# EAGLE design breakout (EAGLE 6.4)
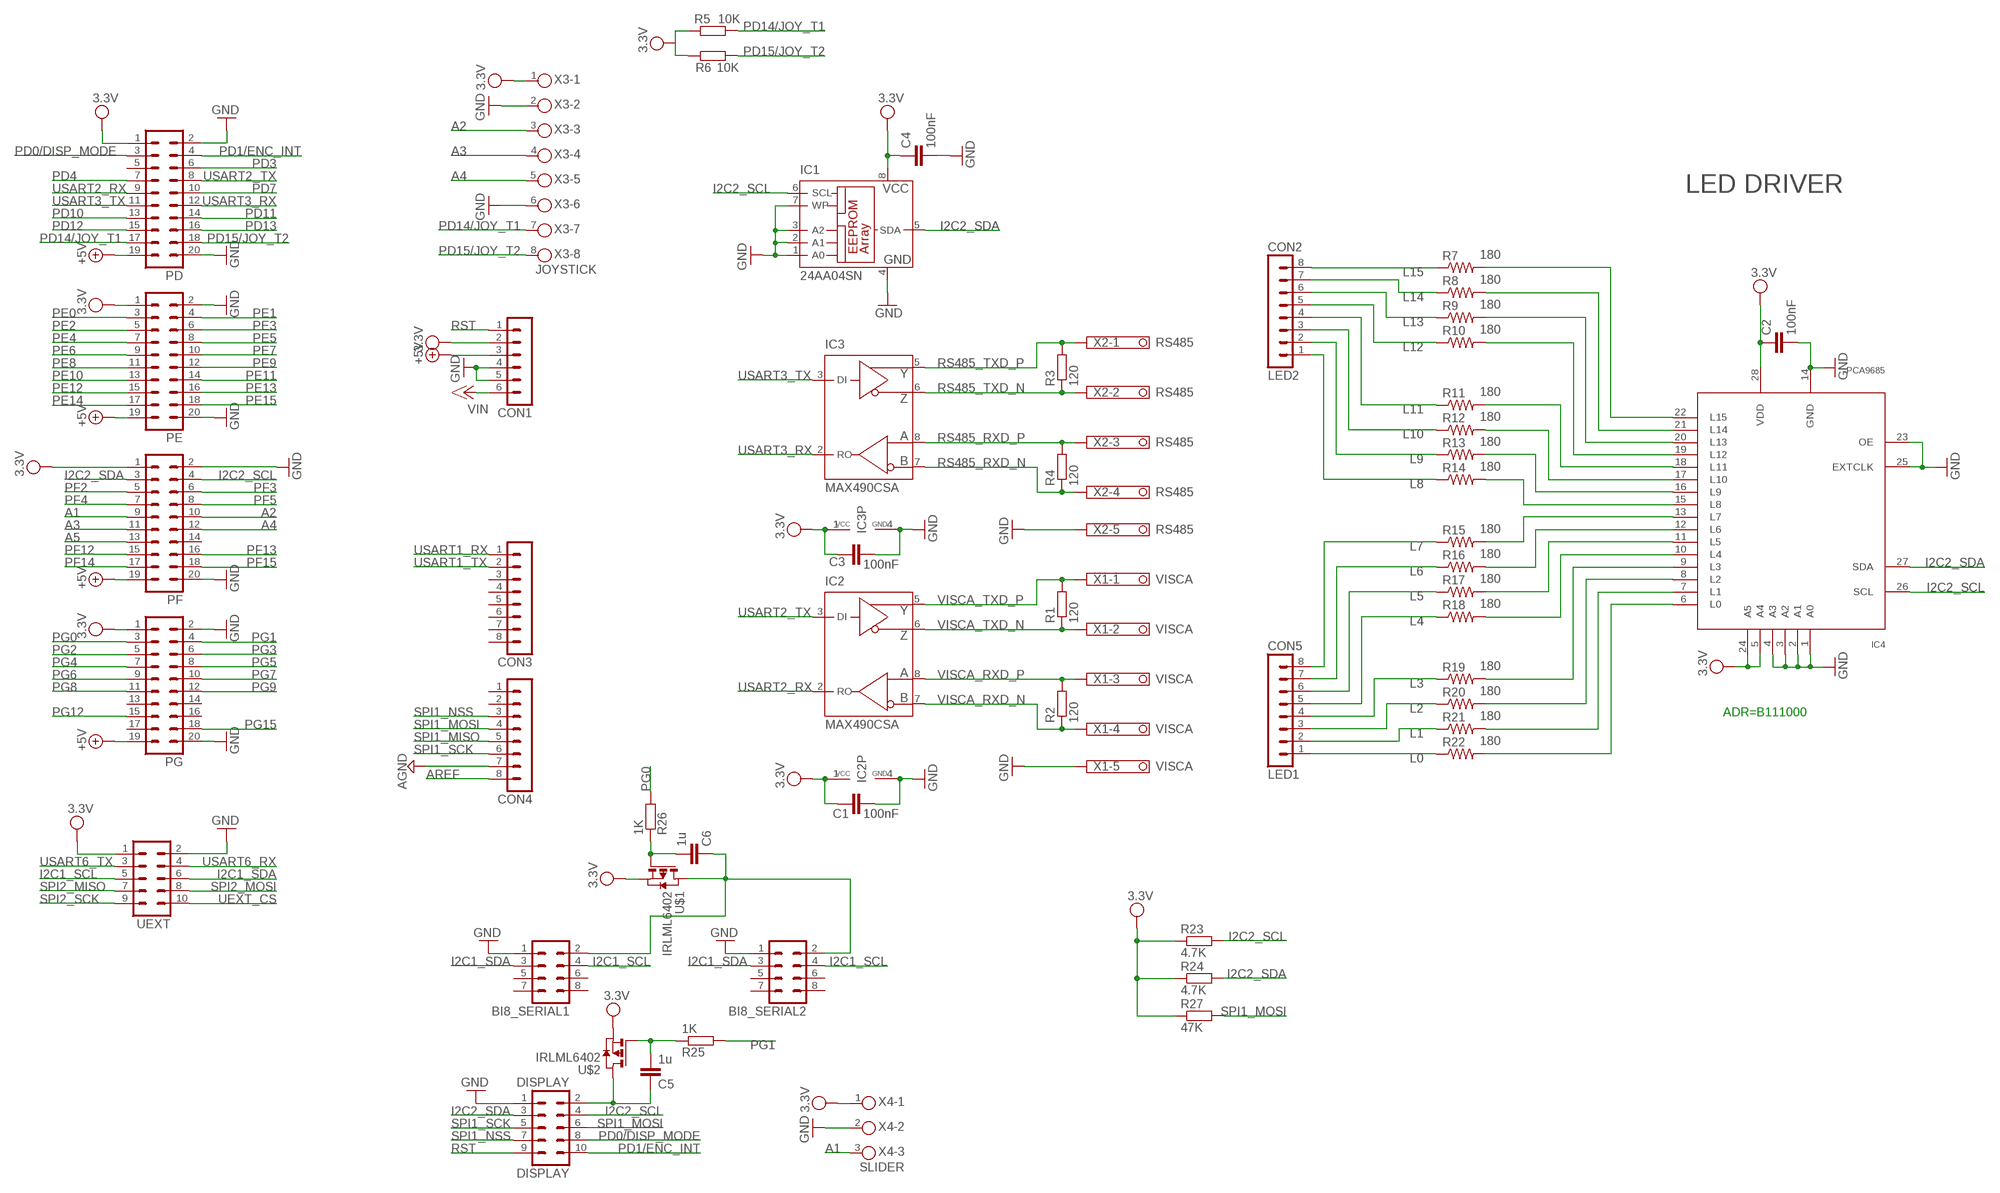
[diagram p0: schematic, sheet 1]

## Parts
BI8_SERIAL1  MA04-2  [MA04-2]
BI8_SERIAL2  MA04-2  [MA04-2]
C1  100nF  CAP0603-CAP  [0603-CAP]
C2  100nF  CAP0603-CAP  [0603-CAP]
C3  100nF  CAP0603-CAP  [0603-CAP]
C4  100nF  CAP0603-CAP  [0603-CAP]
C5  1u  C-EUC0805  [C0805]
C6  1u  C-EUC0805  [C0805]
CON1  MA06-1  [MA06-1]
CON2  LED2  MA08-1  [MA08-1]
CON3  MA08-1  [MA08-1]
CON4  MA08-1  [MA08-1]
CON5  LED1  MA08-1  [MA08-1]
DISPLAY  DISPLAY  MA05-2  [MA05-2]
IC1  24AA04SN  [SO-08]
IC2  MAX490CSA  MAX488CSA  [SO08]
IC3  MAX490CSA  MAX488CSA  [SO08]
IC4  PCA9685  [TSSOP28]
PD  MA10-2  [MA10-2]
PE  MA10-2  [MA10-2]
PF  MA10-2  [MA10-2]
PG  MA10-2  [MA10-2]
R1  120  R-EU_R0603  [R0603]
R2  120  R-EU_R0603  [R0603]
R3  120  R-EU_R0603  [R0603]
R4  120  R-EU_R0603  [R0603]
R5  10K  R-EU_R0603  [R0603]
R6  10K  R-EU_R0603  [R0603]
R7  180  RESISTOR0603-RES  [0603-RES]
R8  180  RESISTOR0603-RES  [0603-RES]
R9  180  RESISTOR0603-RES  [0603-RES]
R10  180  RESISTOR0603-RES  [0603-RES]
R11  180  RESISTOR0603-RES  [0603-RES]
R12  180  RESISTOR0603-RES  [0603-RES]
R13  180  RESISTOR0603-RES  [0603-RES]
R14  180  RESISTOR0603-RES  [0603-RES]
R15  180  RESISTOR0603-RES  [0603-RES]
R16  180  RESISTOR0603-RES  [0603-RES]
R17  180  RESISTOR0603-RES  [0603-RES]
R18  180  RESISTOR0603-RES  [0603-RES]
R19  180  RESISTOR0603-RES  [0603-RES]
R20  180  RESISTOR0603-RES  [0603-RES]
R21  180  RESISTOR0603-RES  [0603-RES]
R22  180  RESISTOR0603-RES  [0603-RES]
R23  4.7K  R-EU_R0603  [R0603]
R24  4.7K  R-EU_R0603  [R0603]
R25  1K  R-EU_R0603  [R0603]
R26  1K  R-EU_R0603  [R0603]
R27  47K  R-EU_R0603  [R0603]
U$1  IRLML6402  [SOT-23]
U$2  IRLML6402  [SOT-23]
UEXT  ML10L  [ML10L]
X1  VISCA  1751277  [1751277]
X2  RS485  1751277  [1751277]
X3  JOYSTICK  AKL59-08  [8POL35]
X4  SLIDER  AKL59-03  [3POL35]

## Nets
+5V: CON1.3 PD.19 PE.19 PF.19 PG.19
A1: PF.9 X4.3
A2: PF.10 X3.3
A3: PF.11 X3.4
A4: PF.12 X3.5
A5: PF.13
AGND: CON4.7
AREF: CON4.8
GND: BI8_SERIAL1.1 BI8_SERIAL2.1 C1.2 C2.2 C3.2 C4.2 CON1.4 CON1.5 DISPLAY.1 IC1.1(A0) IC1.2(A1) IC1.3(A2) IC1.4(GND) IC1.7(WP) IC2.4(GND) IC3.4(GND) IC4.1(A0) IC4.2(A1) IC4.3(A2) IC4.4(A3) IC4.14(GND) IC4.23(OE) IC4.25(EXTCLK) PD.2 PD.20 PE.2 PE.20 PF.2 PF.20 PG.2 PG.20 UEXT.2 X1.5 X2.5 X3.2 X3.6 X4.2
I2C1_SCL: BI8_SERIAL1.4 BI8_SERIAL2.4 UEXT.5
I2C1_SDA: BI8_SERIAL1.3 BI8_SERIAL2.3 UEXT.6
I2C2_SCL: DISPLAY.4 IC1.6(SCL) IC4.26(SCL) PF.4 R23.2
I2C2_SDA: DISPLAY.3 IC1.5(SDA) IC4.27(SDA) PF.3 R24.2
L0: CON5.1 R22.1
L1: CON5.2 R21.1
L2: CON5.3 R20.1
L3: CON5.4 R19.1
L4: CON5.5 R18.1
L5: CON5.6 R17.1
L6: CON5.7 R16.1
L7: CON5.8 R15.1
L8: CON2.1 R14.1
L9: CON2.2 R13.1
L10: CON2.3 R12.1
L11: CON2.4 R11.1
L12: CON2.5 R10.1
L13: CON2.6 R9.1
L14: CON2.7 R8.1
L15: CON2.8 R7.1
N$3: C5.2 R25.1 U$2.1(G)
N$4: IC4.13(L7) R15.2
N$5: IC4.12(L6) R16.2
N$6: C6.2 R26.1 U$1.1(G)
N$7: IC4.11(L5) R17.2
N$8: BI8_SERIAL1.2 BI8_SERIAL2.2 C6.1 U$1.3(D)
N$9: IC4.10(L4) R18.2
N$10: IC4.9(L3) R19.2
N$11: IC4.8(L2) R20.2
N$12: IC4.7(L1) R21.2
N$13: C5.1 DISPLAY.2 U$2.3(D)
N$19: IC4.6(L0) R22.2
N$20: IC4.15(L8) R14.2
N$21: IC4.16(L9) R13.2
N$22: IC4.17(L10) R12.2
N$23: IC4.18(L11) R11.2
N$24: IC4.19(L12) R10.2
N$25: IC4.20(L13) R9.2
N$26: IC4.21(L14) R8.2
N$27: IC4.22(L15) R7.2
PD0/DISP_MODE: DISPLAY.8 PD.3
PD1/ENC_INT: DISPLAY.10 PD.4
PD3: PD.6
PD4: PD.7
PD7: PD.10
PD10: PD.13
PD11: PD.14
PD12: PD.15
PD13: PD.16
PD14/JOY_T1: PD.17 R5.2 X3.7
PD15/JOY_T2: PD.18 R6.2 X3.8
PE0: PE.3
PE1: PE.4
PE2: PE.5
PE3: PE.6
PE4: PE.7
PE5: PE.8
PE6: PE.9
PE7: PE.10
PE8: PE.11
PE9: PE.12
PE10: PE.13
PE11: PE.14
PE12: PE.15
PE13: PE.16
PE14: PE.17
PE15: PE.18
PF2: PF.5
PF3: PF.6
PF4: PF.7
PF5: PF.8
PF12: PF.15
PF13: PF.16
PF14: PF.17
PF15: PF.18
PG0: PG.3 R26.2
PG1: PG.4 R25.2
PG2: PG.5
PG3: PG.6
PG4: PG.7
PG5: PG.8
PG6: PG.9
PG7: PG.10
PG8: PG.11
PG9: PG.12
PG12: PG.15
PG15: PG.18
RS485_RXD_N: IC3.7(B) R4.1 X2.4
RS485_RXD_P: IC3.8(A) R4.2 X2.3
RS485_TXD_N: IC3.6(Z) R3.1 X2.2
RS485_TXD_P: IC3.5(Y) R3.2 X2.1
RST: CON1.1 DISPLAY.9
SPI1_MISO: CON4.5
SPI1_MOSI: CON4.4 DISPLAY.6 R27.2
SPI1_NSS: CON4.3 DISPLAY.7
SPI1_SCK: CON4.6 DISPLAY.5
SPI2_MISO: UEXT.7
SPI2_MOSI: UEXT.8
SPI2_SCK: UEXT.9
UEXT_CS: UEXT.10
USART1_RX: CON3.1
USART1_TX: CON3.2
USART2_RX: IC2.2(RO) PD.9
USART2_TX: IC2.3(DI) PD.8
USART3_RX: IC3.2(RO) PD.12
USART3_TX: IC3.3(DI) PD.11
USART6_RX: UEXT.4
USART6_TX: UEXT.3
VCC: C1.1 C2.1 C3.1 C4.1 CON1.2 IC1.8(VCC) IC2.1(VCC) IC3.1(VCC) IC4.5(A4) IC4.24(A5) IC4.28(VDD) PD.1 PE.1 PF.1 PG.1 R5.1 R6.1 R23.1 R24.1 R27.1 U$1.2(S) U$2.2(S) UEXT.1 X3.1 X4.1 ; supply symbol labelled 3.3V
VIN: CON1.6
VISCA_RXD_N: IC2.7(B) R2.1 X1.4
VISCA_RXD_P: IC2.8(A) R2.2 X1.3
VISCA_TXD_N: IC2.6(Z) R1.1 X1.2
VISCA_TXD_P: IC2.5(Y) R1.2 X1.1
Unconnected: BI8_SERIAL1.5 BI8_SERIAL1.6 BI8_SERIAL1.7 BI8_SERIAL1.8 BI8_SERIAL2.5 BI8_SERIAL2.6 BI8_SERIAL2.7 BI8_SERIAL2.8 CON3.3 CON3.4 CON3.5 CON3.6 CON3.7 CON3.8 CON4.1 CON4.2 PD.5 PF.14 PG.13 PG.14 PG.16 PG.17

## Notes on the sheet
- LED DRIVER
- ADR=B111000

## Library data of the parts
BI8_SERIAL1 BI8_SERIAL2 = con-lstb:MA04-2: PIN HEADER; OC_FARNELL: unknown; OC_NEWARK: unknown
C1-C4 = SparkFun:CAP: Capacitor Standard 0603 ceramic capacitor, and 0.1" leaded capacitor.
C5 C6 = resistor:C-EU: CAPACITOR, European symbol
CON1 = con-lstb:MA06-1: PIN HEADER; OC_FARNELL: unknown; OC_NEWARK: unknown
CON2-CON5 = con-lstb:MA08-1: PIN HEADER; OC_FARNELL: unknown; OC_NEWARK: unknown
DISPLAY = con-lstb:MA05-2: PIN HEADER; OC_FARNELL: unknown; OC_NEWARK: unknown
IC1 = microchip:24*: Serial EEPROM I2C; MF: MICROCHIP; MPN: 24AA04/SN; OC_FARNELL: 1331276; OC_NEWARK: 92C6818
IC2 IC3 = maxim:MAX488: RS485 TRANSEIVER Source: Data sheet <http://datasheets.maxim-ic.com/en/ds/MAX1487-MAX491.pdf>; MF: MAXIM; MPN: MAX488CSA; OC_FARNELL: 3534170; OC_NEWARK: 34C3921
IC4 = wsmith:PCA9685
PD PE PF PG = con-lstb:MA10-2: PIN HEADER; OC_FARNELL: unknown; OC_NEWARK: unknown
R1-R6 R23-R27 = resistor:R-EU_: RESISTOR, European symbol
R7-R22 = SparkFun:RESISTOR: Resistor Basic schematic elements and footprints for 0603, 1206, and PTH resistors.
U$1 U$2 = IRLML6402:IRLML6402
UEXT = con-harting-ml:ML10: HARTING; OC_FARNELL: unknown; OC_NEWARK: unknown
X1 X2 = con-phoenix-350:1751277: MKDS 1/ 5-3,5 Printklemme Nennstrom: 10 A Bemessungsspannung: 160 V Raster: 3,5 mm Polzahl: 5 Montageart: Löten Anschlussart: Schraubanschluss Anschlussrichtung vom Leiter zur Platine: 0° Source: http://eshop.phoenixcontact.com .. 1751277.pdf; OC_FARNELL: unknown; OC_NEWARK: unknown
X3 = con-ria-59:AKL59-08: RIA Anschlussklemme Typ 59, Raster 3,5 mm, Polzahl 8
X4 = con-ria-59:AKL59-03: RIA Anschlussklemme Typ 59, Raster 3,5 mm, Polzahl 3

## Net classes
0 default: width 0.203 mm, drill 0.406 mm, clearance 0.203 mm
1 Power: width 0.406 mm, drill 0.61 mm, clearance 0.203 mm

## Board
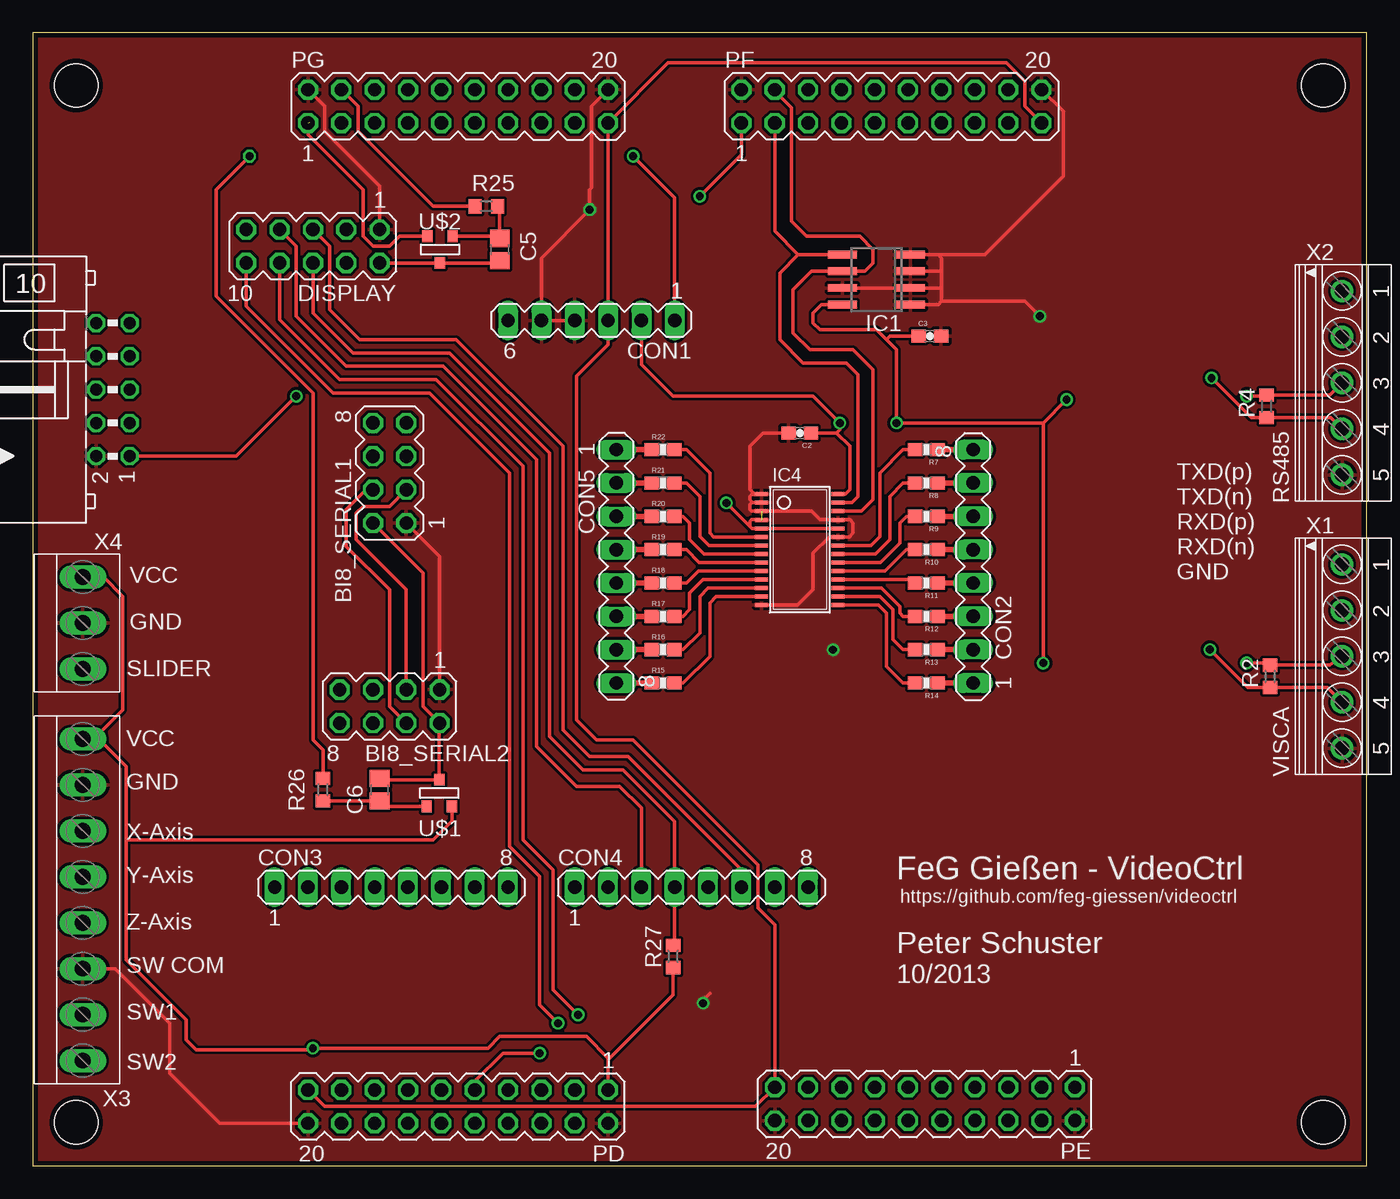
[diagram p1: board, top side]
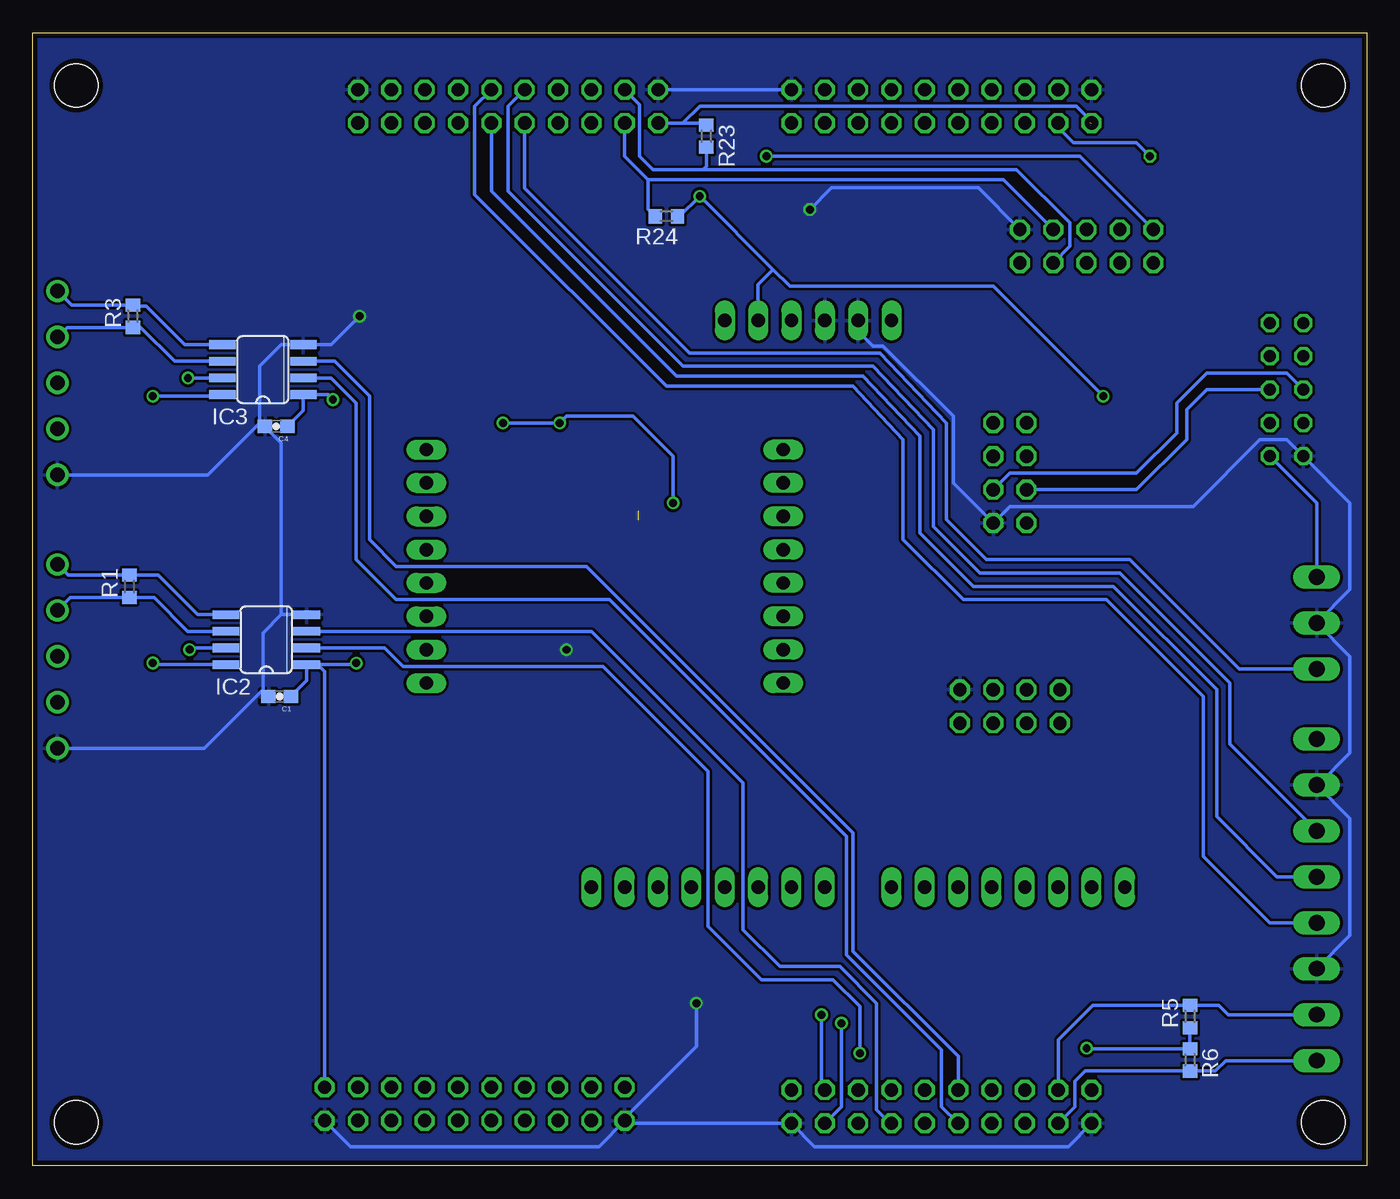
[diagram p2: board, bottom side, seen from below]

Size 101.6 x 86.3 mm. Coordinates in mm from the lower left corner, seen from the top.
Outline: 0,0 101.6,0 101.6,86.3 0,86.3 0,0
Copper layers (1*16): Top 0.0356mm / dielectric 1.5011mm / Bottom 0.0356mm
Design rules "OshPark_PCBOrder": minimum track width 6mil, minimum drill 13mil, track to track 6mil, track to pad 6mil, pad to pad 6mil, via to via 6mil, smd to smd 6mil, copper to edge 15mil, drill to drill 6mil, minimum pad ring 7mil, minimum via ring 7mil, stop-mask expansion 4mil, vias tented up to drill 0mil, thermal gap 10mil
Holes 3.3 mm at 3.3,3.3 3.3,82.3 98.3,3.3 98.3,82.3

### Footprints (pad centres in the part's own frame; a part is rotated, then mirrored left to right if it is on the bottom)
MA04-2 = drill 1.016 octagon: 1 -3.81,-1.27; 2 -3.81,1.27; 3 -1.27,-1.27; 4 -1.27,1.27; 5 1.27,-1.27; 6 1.27,1.27; 7 3.81,-1.27; 8 3.81,1.27
0603-CAP = smd 1.1 x 1: 1 -0.85,0; 2 0.85,0
C0805 = smd 1.3 x 1.5: 1 -0.85,0; 2 0.85,0
MA06-1 = drill 1.016 long: 1 -6.35,0; 2 -3.81,0; 3 -1.27,0; 4 1.27,0; 5 3.81,0; 6 6.35,0
MA08-1 = drill 1.016 long: 1 -8.89,0; 2 -6.35,0; 3 -3.81,0; 4 -1.27,0; 5 1.27,0; 6 3.81,0; 7 6.35,0; 8 8.89,0
MA05-2 = drill 1.016 octagon: 1 -5.08,-1.27; 2 -5.08,1.27; 3 -2.54,-1.27; 4 -2.54,1.27; 5 0,-1.27; 6 0,1.27; 7 2.54,-1.27; 8 2.54,1.27; 9 5.08,-1.27; 10 5.08,1.27
SO-08 = smd 0.6 x 2.2: 1 -1.905,-2.6; 2 -0.635,-2.6; 3 0.635,-2.6; 4 1.905,-2.6; 5 1.905,2.6; 6 0.635,2.6; 7 -0.635,2.6; 8 -1.905,2.6
SO08 = smd 0.66 x 2.032: 1 -1.905,-3.073; 2 -0.635,-3.073; 3 0.635,-3.073; 4 1.905,-3.073; 5 1.905,3.073; 6 0.635,3.073; 7 -0.635,3.073; 8 -1.905,3.073
TSSOP28 = smd 0.305 x 0.991: 1 -4.225,-2.918; 2 -3.575,-2.918; 3 -2.925,-2.918; 4 -2.275,-2.918; 5 -1.625,-2.918; 6 -0.975,-2.918; 7 -0.325,-2.918; 8 0.325,-2.918; 9 0.975,-2.918; 10 1.625,-2.918; 11 2.275,-2.918; 12 2.925,-2.918; 13 3.575,-2.918; 14 4.225,-2.918; 15 4.225,2.918; 16 3.575,2.918; 17 2.925,2.918; 18 2.275,2.918; 19 1.625,2.918; 20 0.975,2.918; 21 0.325,2.918; 22 -0.325,2.918; 23 -0.975,2.918; 24 -1.625,2.918; 25 -2.275,2.918; 26 -2.925,2.918; 27 -3.575,2.918; 28 -4.225,2.918
MA10-2 = drill 1.016 octagon: 1 -11.43,-1.27; 2 -11.43,1.27; 3 -8.89,-1.27; 4 -8.89,1.27; 5 -6.35,-1.27; 6 -6.35,1.27; 7 -3.81,-1.27; 8 -3.81,1.27; 9 -1.27,-1.27; 10 -1.27,1.27; 11 1.27,-1.27; 12 1.27,1.27; 13 3.81,-1.27; 14 3.81,1.27; 15 6.35,-1.27; 16 6.35,1.27; 17 8.89,-1.27; 18 8.89,1.27; 19 11.43,-1.27; 20 11.43,1.27
R0603 = smd 1 x 1.1: 1 -0.85,0; 2 0.85,0
0603-RES = smd 1.1 x 1: 1 -0.85,0; 2 0.85,0
SOT-23 = smd 0.787 x 0.889: 1 0.991,1.016; 2 -0.94,1.016; 3 0.025,-1.016
ML10L = drill 0.914 octagon: 1 -5.08,-1.27; 2 -5.08,1.27; 3 -2.54,-1.27; 4 -2.54,1.27; 5 0,-1.27; 6 0,1.27; 7 2.54,-1.27; 8 2.54,1.27; 9 5.08,-1.27; 10 5.08,1.27
1751277 = drill 1.1 pad 1.7: 1 -7,-0.1; 2 -3.5,-0.1; 3 0,-0.1; 4 3.5,-0.1; 5 7,-0.1
8POL35 = drill 1.2 long: 1 -12.25,0; 2 -8.75,0; 3 -5.25,0; 4 -1.75,0; 5 1.75,0; 6 5.25,0; 7 8.75,0; 8 12.25,0
3POL35 = drill 1.2 long: 1 -3.5,0; 2 0,0; 3 3.5,0

### Placement (x,y rotation side)
BI8_SERIAL1  27.18,52.77 90 top
BI8_SERIAL2  27.18,34.99 180 top
C1  82.8,35.75 180 bottom
C2  58.42,55.82 180 top
C3  68.33,63.18 0 top
C4  83.06,56.32 180 bottom
C5  35.56,69.79 90 top
C6  26.42,28.64 270 top
CON1  42.55,64.39 180 top
CON2  71.63,45.66 90 top
CON3  27.3,21.21 0 top
CON4  50.16,21.21 0 top
CON5  44.45,45.66 270 top
DISPLAY  21.34,70.04 180 top
IC1  64.26,67.5 90 top
IC2  83.82,40.07 90 bottom
IC3  84.07,60.64 90 bottom
IC4  58.42,46.93 270 top
PD  32.38,4.5 180 top
PE  67.94,4.7 180 top
PF  65.4,80.7 0 top
PG  32.38,80.7 0 top
R1  94.23,44.13 90 bottom
R2  94.23,37.27 90 top
R3  93.98,64.71 90 bottom
R4  93.98,57.85 90 top
R5  13.46,11.37 90 bottom
R6  13.46,8.06 270 bottom
R7  68.07,54.55 180 top
R8  68.07,52.01 180 top
R9  68.07,49.47 180 top
R10  68.07,46.93 180 top
R11  68.07,44.39 180 top
R12  68.07,41.85 180 top
R13  68.07,39.31 180 top
R14  68.07,36.77 180 top
R15  48.01,36.77 0 top
R16  48.01,39.31 0 top
R17  48.01,41.85 0 top
R18  48.01,44.39 0 top
R19  48.01,46.93 0 top
R20  48.01,49.47 0 top
R21  48.01,52.01 0 top
R22  48.01,54.55 0 top
R23  50.29,78.42 270 bottom
R24  53.34,72.33 180 bottom
R25  34.54,73.09 180 top
R26  22.1,28.64 90 top
R27  48.77,15.94 90 top
U$1  30.99,28.39 180 top
U$2  30.99,69.79 0 top
UEXT  6.1,59.12 90 top
X1  99.82,38.8 270 top
X2  99.82,59.63 270 top
X3  3.81,20.26 270 top
X4  3.81,41.34 270 top

### Tracks (layer width: path | path; a pad name or v marks a point on that pad's centre or on a via)
+5V
  Top 0.254: PF.19 76.83,79.44 75.56,80.71 75.56,82.61 74.17,84.01 48.4,84.01 PG.19 CON1.3 43.81,62.55 41.4,60.13 41.4,33.97 42.93,32.45 45.72,32.45 55.24,22.92 55.24,19.62 56.52,18.35 PE.19 55.05,4.51 22.21,4.51 PD.19
A1
  Bottom 0.254: X4.3 9.71,37.84 18.03,46.16 28.96,46.16 32,49.21 32,56.58 37.08,61.91 51.56,61.91 64.13,74.48 PF.9
A2
  Bottom 0.254: X3.3 10.41,32.11 10.41,36.77 18.8,45.15 29.46,45.15 33.02,48.7 33.02,56.07 37.59,60.9 52.07,60.9 65.41,74.23 65.41,80.71 64.14,81.97 PF.10
A3
  Bottom 0.254: PF.11 66.67,74.23 52.58,60.13 38.35,60.13 34.04,55.56 34.04,48.2 29.97,44.13 19.3,44.13 11.43,36.26 11.43,26.61 6.83,22.01 X3.4
A4
  Bottom 0.254: X3.5 7.39,18.51 12.45,23.56 12.45,35.75 19.81,43.12 30.73,43.12 35.31,47.69 35.31,55.31 39.12,59.37 53.34,59.37 67.94,73.98 67.94,80.69 PF.12
GND  (via drill 0.6)  (1 unrouted)
  Top 0.254: IC1.7 IC1.2 69.09,66.87 69.22,66.74 | 54.74,50.61 54.74,50.48 54.61,50.36 54.61,49.98 54.73,49.85 IC4.3 59.3,49.85 59.94,49.21 61.33,49.21 IC4.25 61.35,49.21 62.23,49.21 62.48,48.96 62.48,48.2 62.19,47.9 IC4.23 60.66,47.9 59.44,46.67 59.44,43.88 58.26,42.7 IC4.14 | 54.74,50.61 54.61,50.74 54.61,50.99 54.74,51.12 55.47,51.12 IC4.1 54.96,51.15 54.61,51.5 54.61,54.8 55.63,55.82 C2.2 | IC4.2 54.84,50.5 54.74,50.61 | IC1.3 69.09,68.14 | 69.09,68.14 69.22,68.14 69.22,66.74 | 69.22,66.74 69.22,65.85 | 69.22,65.85 68.96,65.6 IC1.1 | IC1.4 68.96,69.41 | 68.96,69.41 69.22,69.15 69.22,68.26 69.09,68.14 | PF.20 78.49,80.31 78.49,75.38 72.52,69.41 68.96,69.41 | X3.6 6.27,15.01 10.41,10.86 10.41,7.05 14.22,3.24 PD.20 | 69.22,65.85 75.56,65.85 v76.71,64.71 | DISPLAY.1 26.42,74.61 22.23,78.8 22.23,80.7 PG.2 | BI8_SERIAL2.1 30.99,46.42 BI8_SERIAL1.1 | CON1.4 CON1.5 | PG.20 42.55,80.71 42.55,74.49 42.42,74.36 v42.42,72.83 38.73,69.15 38.73,65.34 | v51.05,12.38 51.05,12.64 51.56,13.14
  Bottom 0.254: X1.5 88.53,31.8 84.07,36.26 84.07,40.58 82.68,41.97 | 82.68,41.97 IC2.4 | 84.33,56.71 84.33,60.9 82.68,62.55 IC3.4 78.87,62.55 v76.71,64.71 | 84.33,56.71 84.33,56.58 88.28,52.63 X2.5 | 82.68,41.97 82.68,55.05 84.33,56.71 | PE.2 77.41,1.46 58.48,1.46 PE.20 56.31,3.23 PD.2 42.05,1.46 22.72,1.46 PD.20 | PG.20 PF.2 | X3.6 1.27,17.55 1.27,26.47 X3.2 3.7,29.01 1.27,31.43 1.27,38.8 X4.2 1.27,43.88 1.27,50.48 UEXT.2 6.1,55.31 8.13,55.31 13.21,50.23 27.18,50.23 BI8_SERIAL1.1 31.5,52.01 31.5,57.09 36.83,62.42 37.59,62.42 38.73,63.56 CON1.5 | v51.05,12.38 51.05,9.08 56.64,3.49 | DISPLAY.1 29.59,74.49 40.77,74.49 v42.42,72.83
  other vias: 60.96,39.31
  pour Top: -1.02,87.31 103.12,87.31 103.12,-1.33 -1.02,-1.33
  pour Bottom: -1.02,88.58 103.12,88.58 103.12,-1.59 -1.02,-1.59
I2C1_SCL
  Top 0.254: BI8_SERIAL2.4 27.18,34.99 27.18,43.88 23.88,47.18 23.88,49.98 25.4,51.5 BI8_SERIAL1.4
  Bottom 0.254: BI8_SERIAL1.4 17.53,51.5 13.72,55.31 13.72,57.59 12.19,59.12 UEXT.5
I2C1_SDA
  Top 0.254: BI8_SERIAL2.3 28.45,43.88 24.64,47.69 24.64,49.72 25.15,50.23 27.18,50.23 BI8_SERIAL1.3
  Bottom 0.254: BI8_SERIAL1.3 27.18,52.77 17.53,52.77 14.48,55.82 14.48,58.1 12.19,60.39 6.1,60.39 UEXT.6
I2C2_SCL
  Top 0.254: IC4.26 63.12,49.85 64.01,50.74 64.01,60.64 62.48,62.17 59.18,62.17 57.91,63.44 57.91,66.74 59.31,68.14 IC1.6 63.37,68.14 64.01,68.77 64.01,69.79 62.99,70.8 58.93,70.8 57.78,71.95 57.78,80.58 56.51,81.86 PF.4
  Bottom 0.254: PF.4 55.37,80.83 55.37,76.9 54.36,75.88 50.55,75.88 | 50.55,75.88 26.67,75.88 22.61,71.82 22.61,70.04 DISPLAY.4 | R23.2 50.29,76.14 50.55,75.88
I2C2_SDA
  Top 0.254: IC1.5 58.29,69.41 | 58.29,69.41 56.51,71.19 PF.3 | IC4.27 62.38,50.5 62.87,50.99 62.87,60.26 61.98,61.15 58.67,61.15 56.9,62.93 56.9,68.01 58.29,69.41
  Bottom 0.254: DISPLAY.3 27.69,75.12 54.73,75.12 | 54.73,75.12 56.51,76.9 PF.3 | R24.2 54.73,72.87 54.73,75.12
L0
  Top 0.406: CON5.1 R22.1
L1
  Top 0.406: 47.24,52.01 R21.1 CON5.2
L2
  Top 0.406: R20.1 CON5.3
L3
  Top 0.406: R19.1 CON5.4
L4
  Top 0.406: R18.1 CON5.5
L5
  Top 0.406: R17.1 CON5.6
L6
  Top 0.406: R16.1 CON5.7
L7
  Top 0.406: R15.1 CON5.8
L8
  Top 0.406: CON2.1 R14.1
L9
  Top 0.406: CON2.2 R13.1
L10
  Top 0.406: CON2.3 R12.1
L11
  Top 0.406: CON2.4 R11.1
L12
  Top 0.406: R10.1 CON2.5
L13
  Top 0.406: R9.1 CON2.6
L14
  Top 0.406: R8.1 CON2.7
L15
  Top 0.406: CON2.8 R7.1
N$3
  Top 0.254: R25.1 35.56,72.92 C5.2 35.39,70.8 U$2.1
N$4
  Top 0.254: IC4.13 52.05,43.35 51.56,42.86 51.56,38.8 49.53,36.77 R15.2
N$5
  Top 0.254: IC4.12 51.43,44 50.8,43.37 50.8,40.58 49.53,39.31 R16.2
N$6
  Top 0.254: R26.1 C6.2 27.09,27.37 U$1.1
N$7
  Top 0.254: IC4.11 51.06,44.65 50.04,43.62 50.04,42.35 49.53,41.85 R17.2
N$8
  Top 0.254: BI8_SERIAL1.2 29.72,45.15 29.72,34.99 BI8_SERIAL2.2 30.96,33.69 U$1.3 26.76,29.4 C6.1
N$9
  Top 0.254: IC4.10 50.7,45.3 49.78,44.39 R18.2
N$10
  Top 0.254: IC4.9 50.76,45.95 49.78,46.93 R19.2
N$11
  Top 0.254: IC4.8 51.12,46.6 50.04,47.69 50.04,48.96 49.53,49.47 R20.2
N$12
  Top 0.254: IC4.7 51.49,47.25 50.8,47.94 50.8,50.99 49.78,52.01 R21.2
N$13
  Top 0.254: DISPLAY.2 U$2.3 35.39,68.77 C5.1
N$19
  Top 0.254: IC4.6 51.86,47.9 51.56,48.2 51.56,52.77 49.78,54.55 R22.2
N$20
  Top 0.254: IC4.15 64.42,42.7 65.02,42.1 65.02,38.04 66.29,36.77 R14.2
N$21
  Top 0.254: IC4.16 64.53,43.35 65.53,42.35 65.53,40.07 66.29,39.31 R13.2
N$22
  Top 0.254: IC4.17 64.65,44 66.04,42.61 66.04,42.1 66.29,41.85 R12.2
N$23
  Top 0.254: IC4.18 66.96,44.65 R11.2
N$24
  Top 0.254: IC4.19 64.92,45.3 66.55,46.93 R10.2
N$25
  Top 0.254: IC4.20 64.56,45.95 66.04,47.43 66.04,48.96 66.55,49.47 R9.2
N$26
  Top 0.254: IC4.21 64.19,46.6 65.28,47.69 65.28,50.99 66.29,52.01 R8.2
N$27
  Top 0.254: IC4.22 63.83,47.25 64.52,47.94 64.52,52.77 66.29,54.55 R7.2
PD0/DISP_MODE  (via drill 0.6)
  Top 0.254: DISPLAY.8 18.8,64.45 23.37,59.88 30.73,59.88 37.34,53.28 37.34,24.83 39.62,22.54 39.62,13.4 v41.53,11.49
  Bottom 0.254: PD.3 41.53,6.03 v41.53,11.49
PD1/ENC_INT  (via drill 0.6)
  Top 0.254: DISPLAY.10 16.26,65.47 22.86,58.86 30.23,58.86 36.32,52.77 36.32,24.32 38.61,22.04 38.61,12.26 v40.01,10.86
  Bottom 0.254: v40.01,10.86 40.01,4.5 PD.4
PD14/JOY_T1
  Bottom 0.254: X3.7 10.55,11.51 11.26,12.22 R5.2 20.87,12.22 23.5,9.59 PD.17
PD15/JOY_T2
  Bottom 0.254: X3.8 10.73,8.01 11.52,7.21 R6.2 21.42,7.21 22.23,6.41 22.23,4.5 PD.18
PG0  (via drill 0.6)
  Top 0.254: R26.2 22.1,31.69 21.34,32.45 21.34,58.86 13.97,66.23 13.97,74.36 v16.51,76.9
  Bottom 0.254: v16.51,76.9 17.53,77.91 22.35,77.91 23.5,79.06 PG.3
PG1
  Top 0.254: R25.2 30.48,73.09 24.77,78.8 24.77,80.71 23.5,81.97 PG.4
RS485_RXD_N  (via drill 0.6)
  Top 0.254: X2.4 98.85,57 R4.1 92.8,57 v89.79,60.01
  Bottom 0.254: IC3.7 v89.79,60.01
RS485_RXD_P  (via drill 0.6)
  Top 0.254: X2.3 98.79,58.7 R4.2 93.89,58.61 v92.46,58.61
  Bottom 0.254: IC3.8 87.27,58.61 v92.46,58.61
RS485_TXD_N
  Bottom 0.254: IC3.6 90.81,61.28 93.38,63.86 R3.1 98.99,63.86 X2.2
RS485_TXD_P
  Bottom 0.254: IC3.5 90.04,62.55 92.96,65.47 93.89,65.47 R3.2 98.65,65.56 X2.1
RST  (via drill 0.6)
  Top 0.254: v45.72,76.9 48.9,73.72 CON1.1
  Bottom 0.254: DISPLAY.9 21.84,76.9 v45.72,76.9
SPI1_MOSI
  Top 0.254: DISPLAY.6 21.34,64.96 24.38,61.91 31.75,61.91 39.37,54.29 39.37,32.7 41.91,30.16 44.96,30.16 48.9,26.23 CON4.4 48.9,16.79 R27.2
SPI1_NSS
  Top 0.254: CON4.3 46.35,27.24 44.7,28.89 41.4,28.89 38.35,31.94 38.35,53.78 31.24,60.9 23.88,60.9 20.07,64.71 20.07,70.04 DISPLAY.7
SPI1_SCK
  Top 0.254: DISPLAY.5 22.61,70.04 22.61,65.22 24.89,62.93 32.26,62.93 40.39,54.8 40.39,33.21 42.42,31.18 45.34,31.18 53.98,22.54 CON4.6
USART2_RX  (via drill 0.6)
  Top 0.254: v38.61,8.57 35.81,8.57 33.66,6.41 PD.9
  Bottom 0.254: v38.61,8.57 38.61,12.13 40.64,14.16 46.1,14.16 50.16,18.23 50.16,30.04 58.17,38.04 73.41,38.04 74.8,39.43 IC2.2
USART2_TX
  Bottom 0.254: IC2.3 59.05,40.7 47.5,29.15 47.5,17.97 44.7,15.18 40.13,15.18 37.34,12.38 37.34,4.25 36.31,3.23 PD.8
USART3_RX
  Bottom 0.254: PD.12 32.38,4.5 32.38,8.83 39.62,16.07 39.62,25.08 57.66,43.12 73.91,43.12 76.96,46.16 76.96,58.1 78.87,60.01 IC3.2
USART3_TX
  Bottom 0.254: IC3.3 78.61,61.28 75.95,58.61 75.95,47.69 73.91,45.66 59.44,45.66 39.12,25.34 39.12,16.32 31.11,8.32 PD.11
VCC  (via drill 0.6)  (1 unrouted)
  Top 0.254: IC4.5 IC4.24 54.76,48.55 54.61,48.7 | 54.61,48.7 54.61,49.09 54.74,49.21 55.49,49.21 | v76.96,38.29 76.96,56.58 | 76.96,56.58 v78.74,58.36 | 60.33,65.6 IC1.8 60.07,65.6 59.44,64.96 59.44,64.2 59.94,63.69 64.26,63.69 65.02,62.93 | 43.81,8.06 43.81,8.19 42.16,9.84 35.56,9.84 34.67,8.95 v21.34,8.95 21.21,8.83 12.45,8.83 11.68,9.59 11.68,11.11 7.11,15.69 7.11,24.83 | 43.81,8.06 PD.1 | PG.1 20.95,78.55 25.15,74.36 25.15,70.8 25.91,70.04 27.18,70.04 27.94,70.8 U$2.2 | X4.1 5.39,44.84 6.86,43.37 6.86,34.73 4.57,32.45 3.87,32.45 X3.1 5.02,32.51 7.11,30.42 7.11,24.83 | v20.07,58.61 15.49,54.04 UEXT.1 | IC4.28 61.88,51.15 62.23,51.5 62.23,54.8 61.21,55.82 | 61.21,55.82 C2.1 | 76.96,56.58 v65.79,56.58 65.79,62.17 65.02,62.93 | 61.21,55.82 61.47,56.07 v61.47,56.58 59.44,58.61 48.77,58.61 46.35,61.02 CON1.2 | v50.8,73.85 53.97,77.02 PF.1 | 54.61,48.7 v52.83,50.48 | C3.1 65.28,63.18 65.02,62.93 | U$1.2 31.93,26.28 30.48,24.83 7.11,24.83 | R27.1 48.77,13.02 43.81,8.06
  Bottom 0.254: PE.1 79.38,37.66 80.01,38.29 80.62,38.29 IC2.1 | IC2.1 77.09,38.16 v76.96,38.29 | v78.74,58.36 79.12,58.74 IC3.1 81,57.53 C4.1 | R5.1 R6.1 21.3,8.91 v21.34,8.95 | X4.1 3.81,50.48 UEXT.1 | v20.07,58.61 28.45,66.99 43.94,66.99 45.21,68.26 | v65.79,56.58 v61.47,56.58 60.96,57.09 55.88,57.09 52.83,54.04 v52.83,50.48 | CON1.2 46.35,67.12 45.21,68.26 | 45.21,68.26 v50.8,73.85 52.32,72.33 R24.1 | R23.1 50.45,79.43 52.06,79.43 | 52.06,79.43 PF.1 | IC2.1 80.75,36.96 C1.1 | 21.08,79.69 22.1,80.71 50.8,80.71 52.07,79.44 52.06,79.43 | 21.08,79.44 21.08,79.69 | 21.08,79.69 20.83,79.44
VISCA_RXD_N  (via drill 0.61)
  Top 0.254: X1.4 98.6,36.42 R2.1 92.54,36.42 v89.66,39.31
  Bottom 0.254: IC2.7 89.53,39.43 v89.66,39.31
VISCA_RXD_P  (via drill 0.61)
  Top 0.254: X1.3 98.79,38.12 R2.2 93.81,38.29 v92.46,38.29
  Bottom 0.254: IC2.8 92.33,38.16 v92.46,38.29
VISCA_TXD_N
  Bottom 0.254: X1.2 98.74,43.28 R1.1 92.37,43.28 89.79,40.7 IC2.6
VISCA_TXD_P
  Bottom 0.254: IC2.5 89.03,41.97 92.04,44.98 R1.2 98.91,44.98 X1.1

### Text on the board
tNames: VCC | TXD(p) / TXD(n) / RXD(p) / RXD(n) / GND | GND | SLIDER | VCC | GND | X-Axis | Y-Axis | FeG Gießen - VideoCtrl | https://github.com/feg-giessen/videoctrl | Z-Axis | Peter Schuster | SW COM | 10/2013 | SW1 | SW2